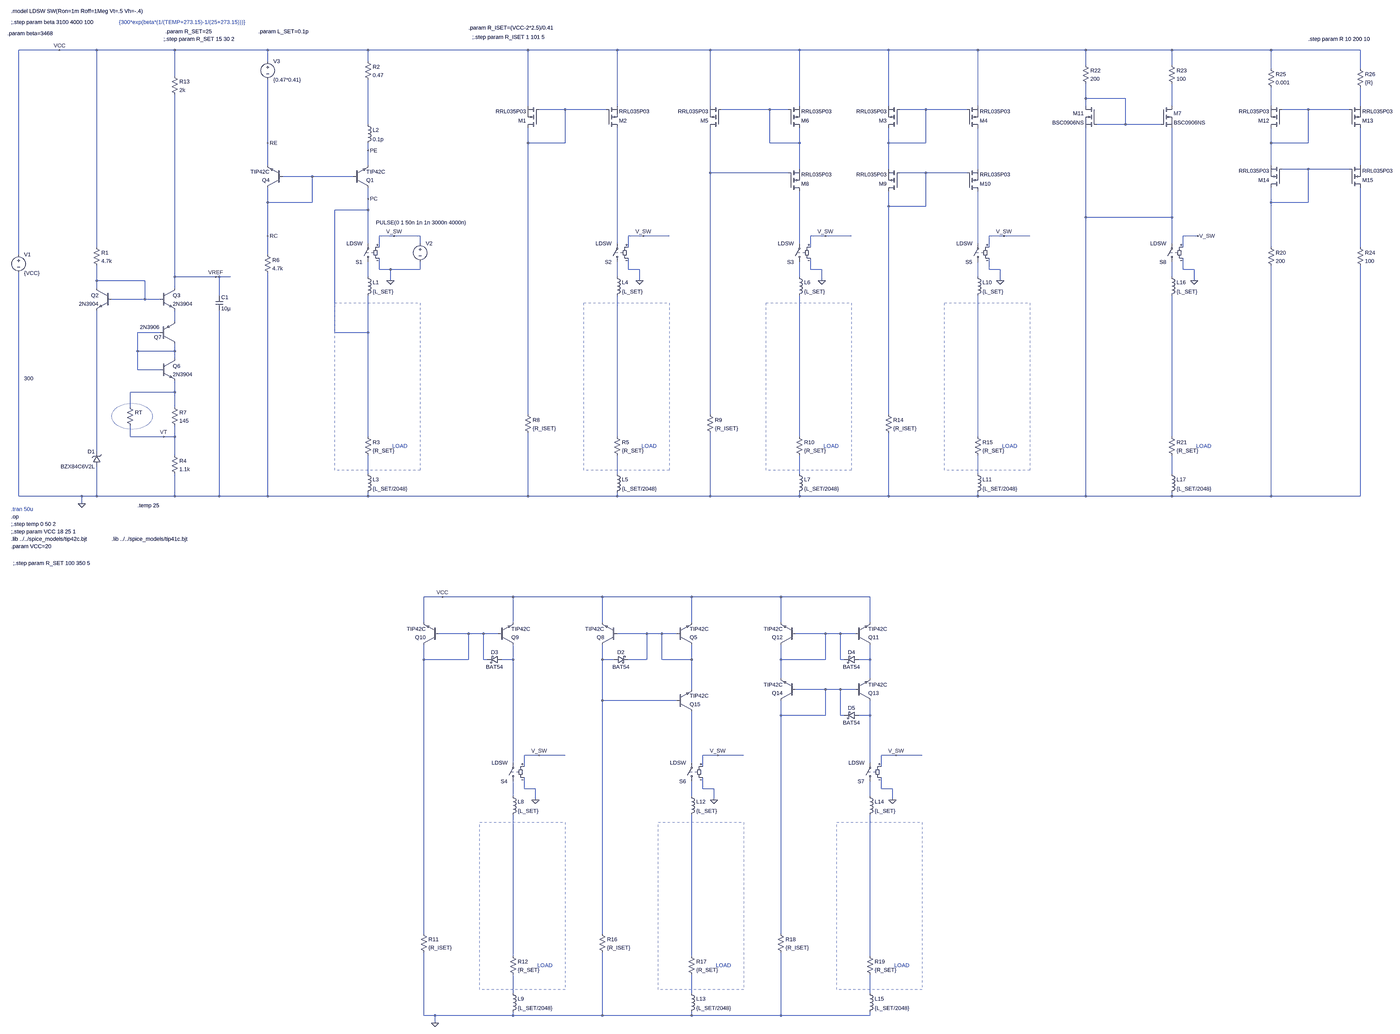
[diagram p0: schematic current_source_back_to_basics.asc, whole sheet]
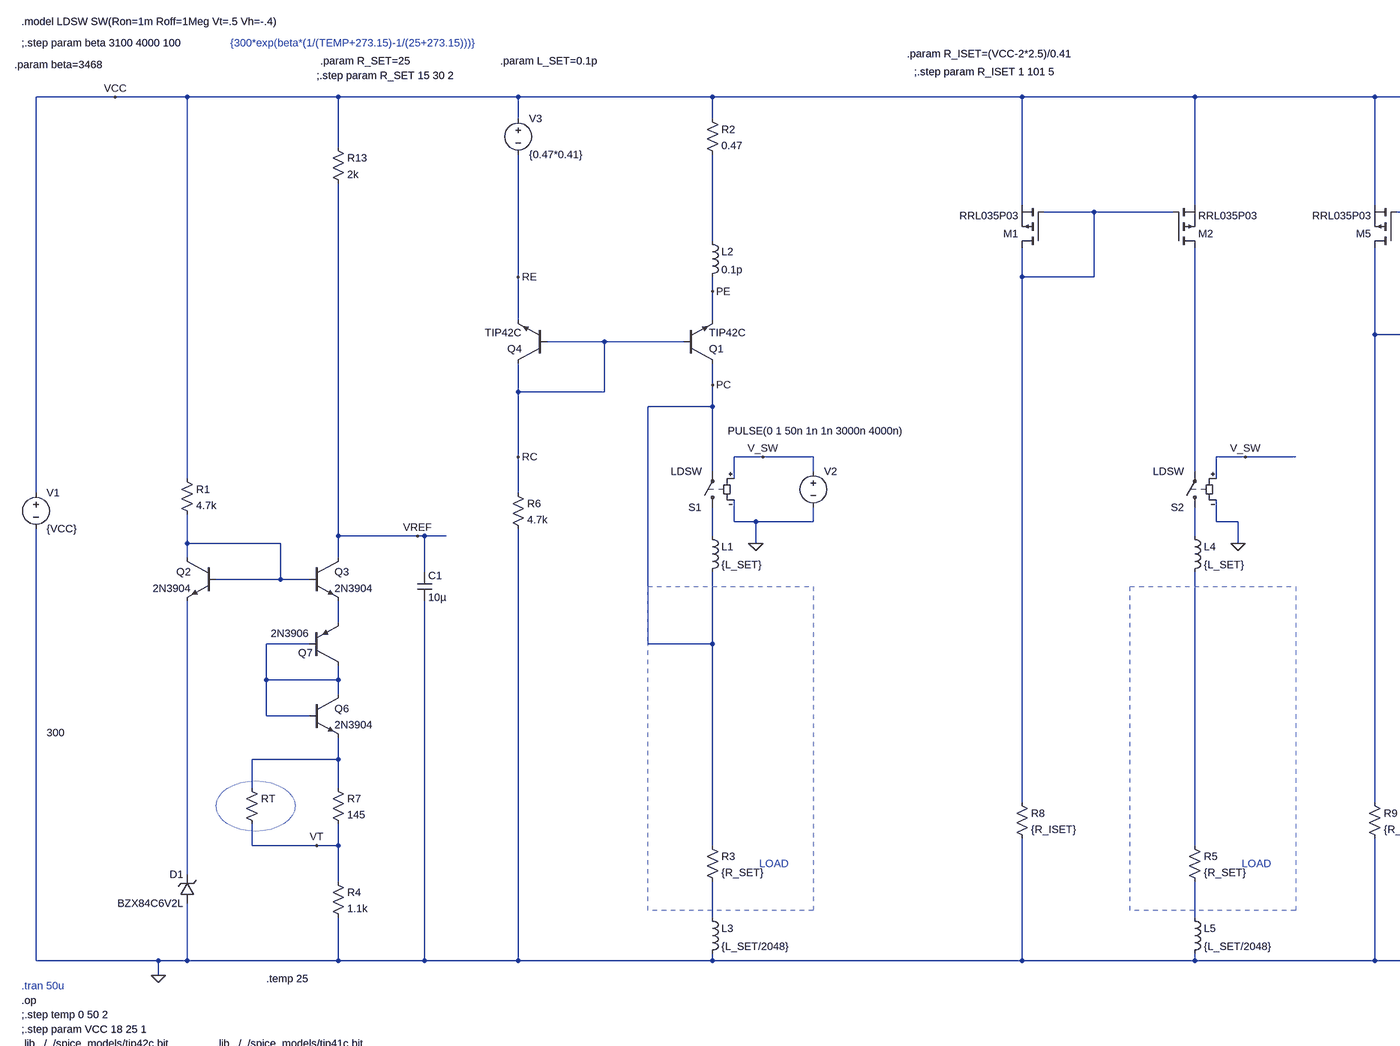
[diagram p1: schematic current_source_back_to_basics.asc, part, row 1 of 2, column 1 of 2]
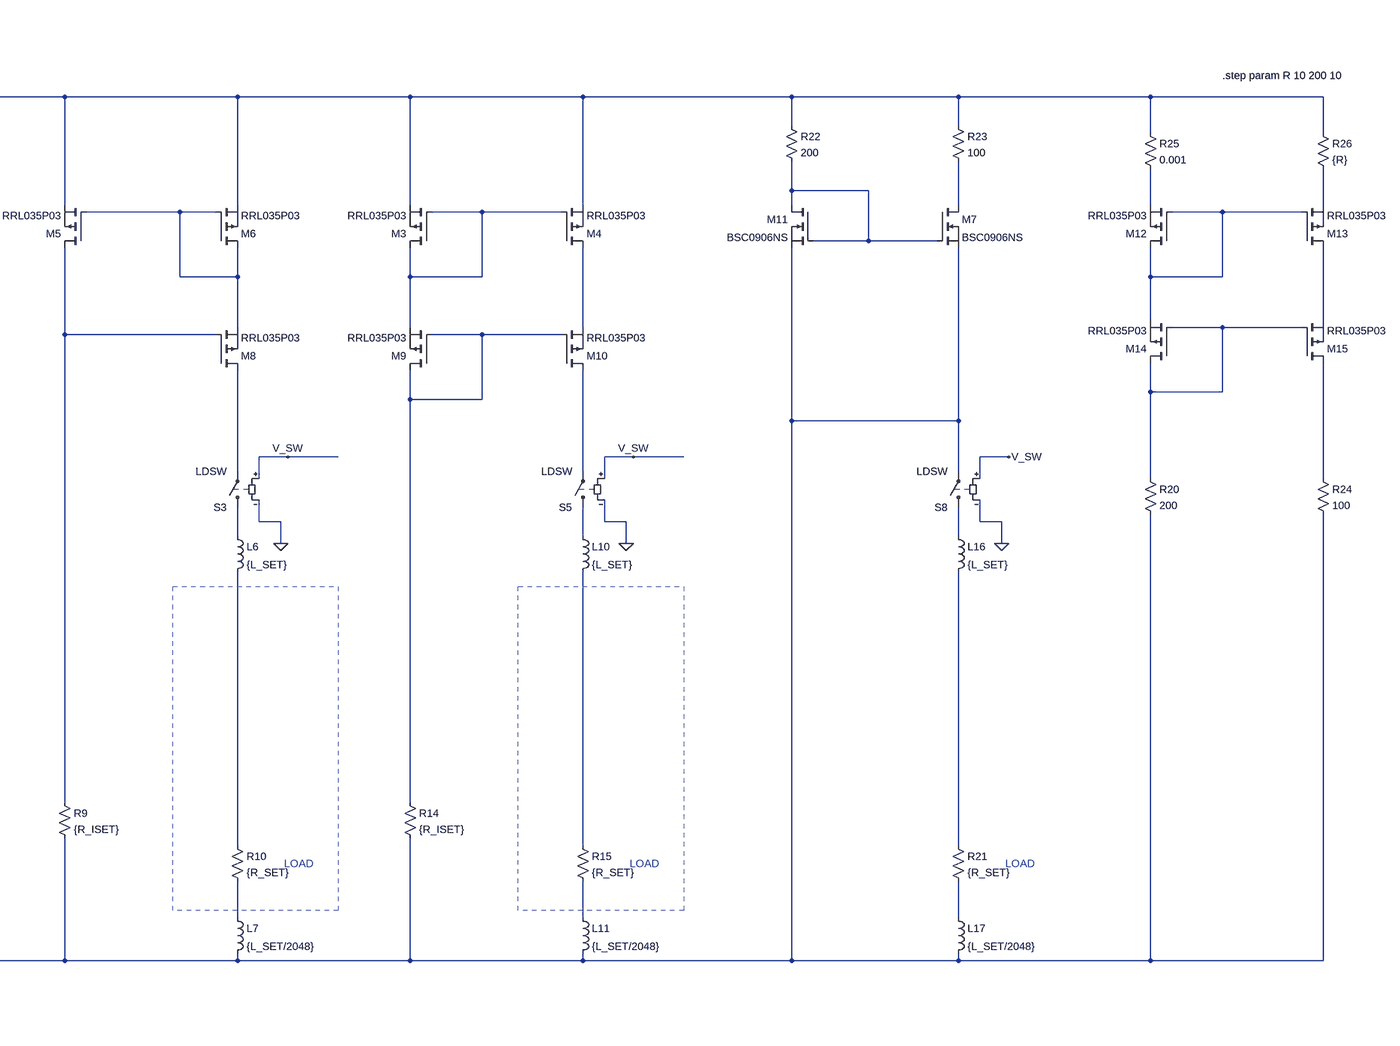
[diagram p2: schematic current_source_back_to_basics.asc, part, row 1 of 2, column 2 of 2]
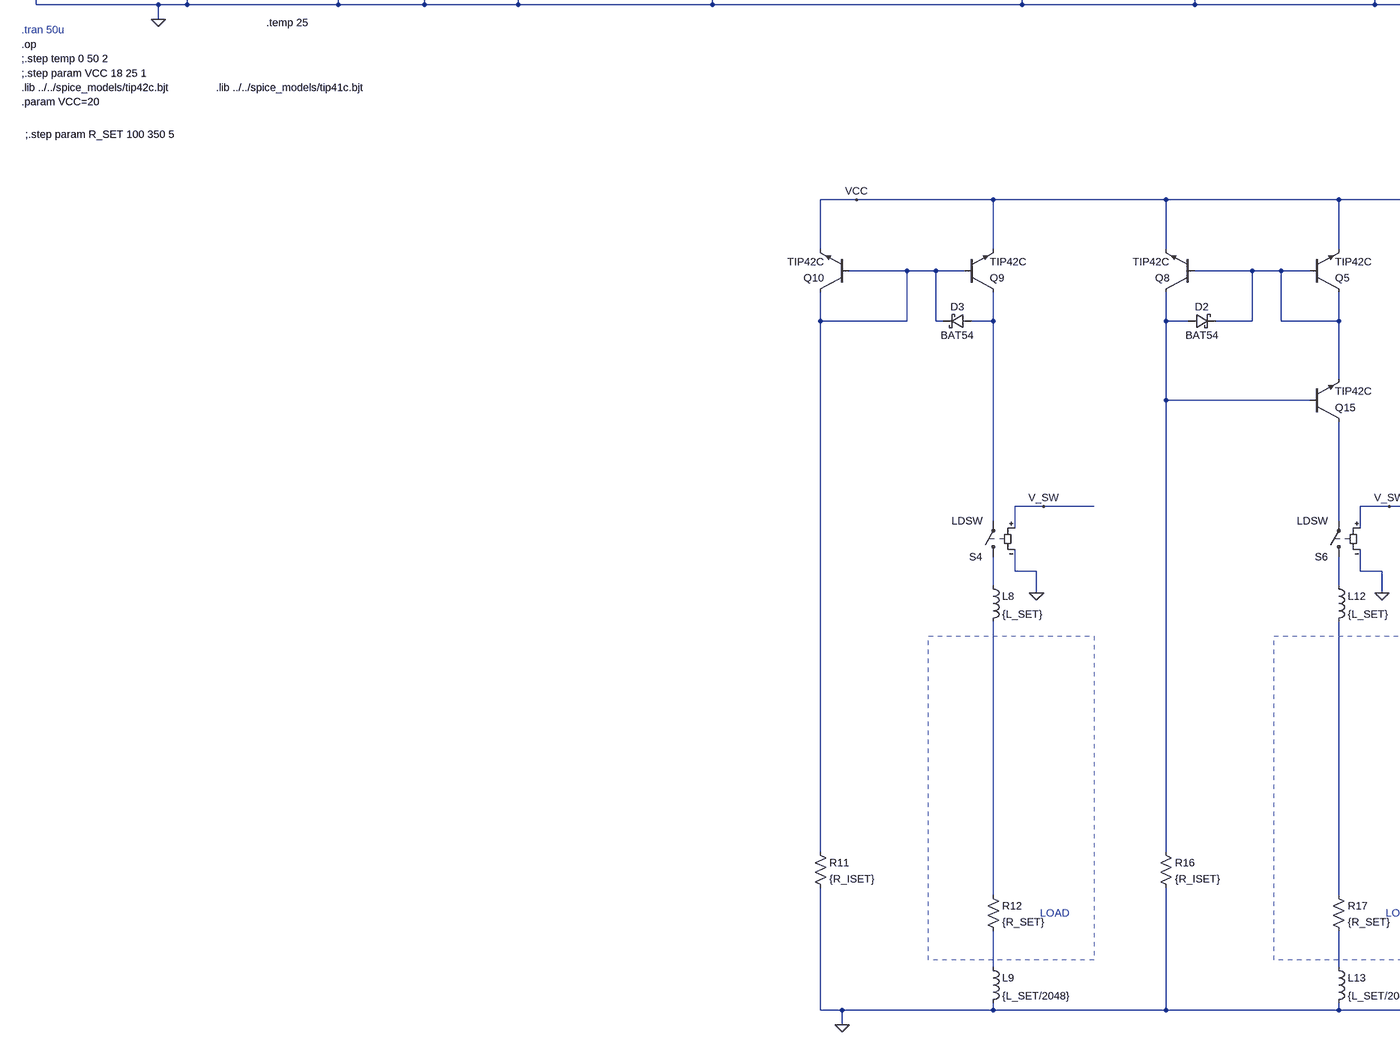
[diagram p3: schematic current_source_back_to_basics.asc, part, row 2 of 2, column 1 of 2]
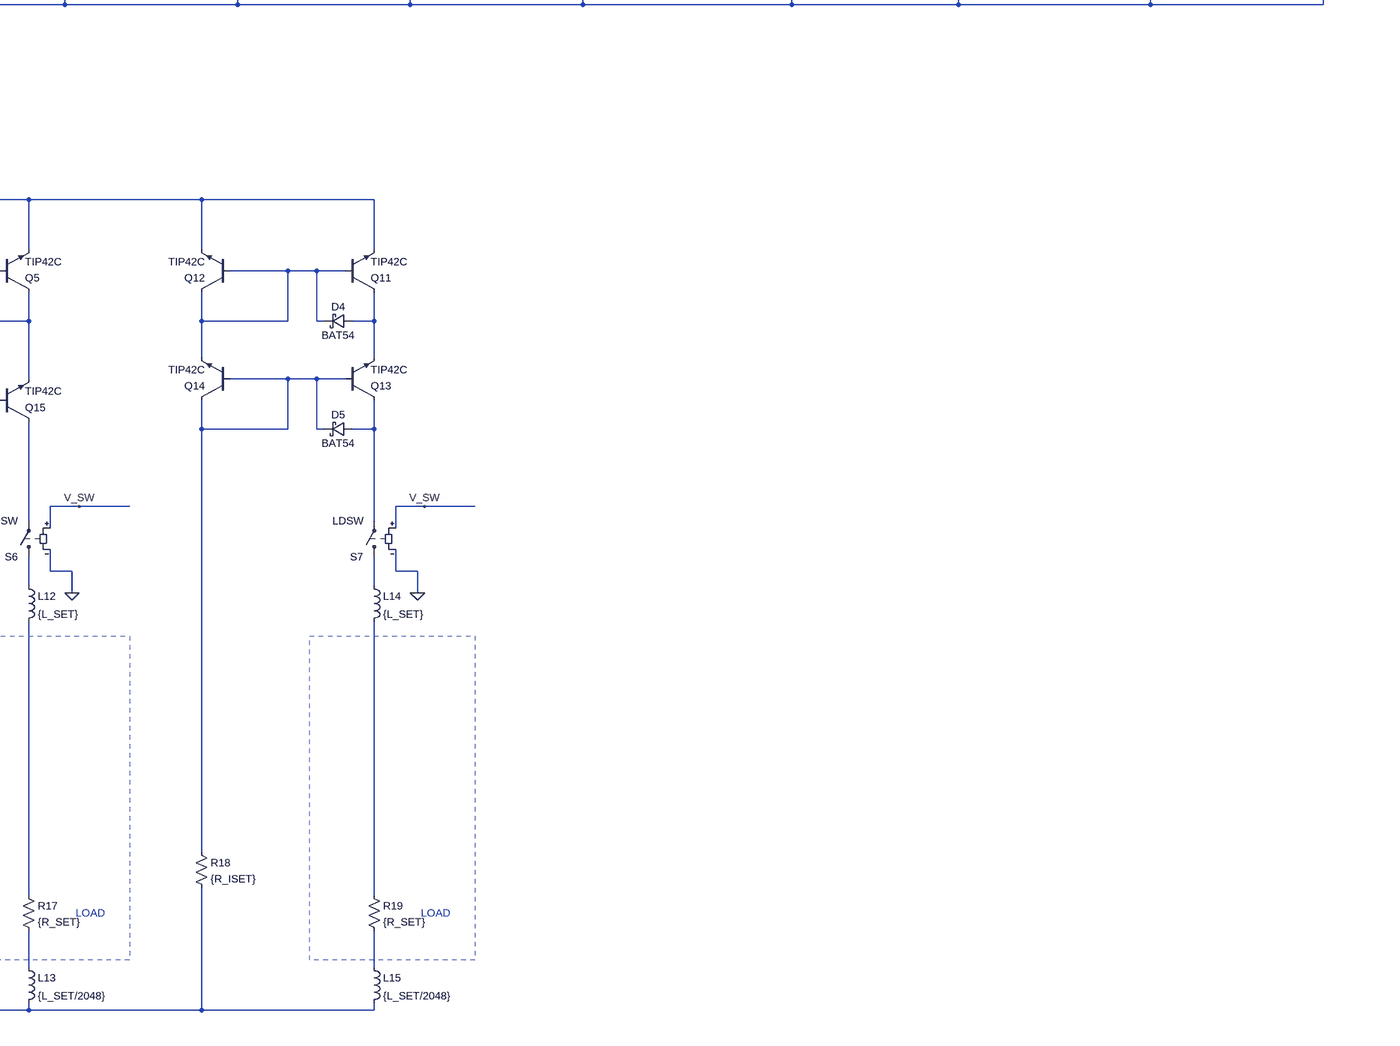
[diagram p4: schematic current_source_back_to_basics.asc, part, row 2 of 2, column 2 of 2]
current_source_back_to_basics.asc, the LTspice schematic file:
Version 4
SHEET 1 5236 3044
WIRE -528 -1328 -704 -1328
WIRE -368 -1328 -528 -1328
WIRE -32 -1328 -368 -1328
WIRE 368 -1328 -32 -1328
WIRE 800 -1328 368 -1328
WIRE 1488 -1328 800 -1328
WIRE 1872 -1328 1488 -1328
WIRE 2272 -1328 1872 -1328
WIRE 2656 -1328 2272 -1328
WIRE 3040 -1328 2656 -1328
WIRE 3424 -1328 3040 -1328
WIRE 3888 -1328 3424 -1328
WIRE 4272 -1328 3888 -1328
WIRE 4704 -1328 4272 -1328
WIRE 5088 -1328 4704 -1328
WIRE 368 -1280 368 -1328
WIRE 800 -1280 800 -1328
WIRE 3888 -1264 3888 -1328
WIRE 4272 -1264 4272 -1328
WIRE 4704 -1248 4704 -1328
WIRE 5088 -1248 5088 -1328
WIRE -32 -1216 -32 -1328
WIRE 3888 -1120 3888 -1184
WIRE 4064 -1120 3888 -1120
WIRE 1488 -1088 1488 -1328
WIRE 1872 -1088 1872 -1328
WIRE 2272 -1088 2272 -1328
WIRE 2656 -1088 2656 -1328
WIRE 3040 -1088 3040 -1328
WIRE 3424 -1088 3424 -1328
WIRE 3888 -1088 3888 -1120
WIRE 4272 -1088 4272 -1184
WIRE 4704 -1088 4704 -1168
WIRE 5088 -1088 5088 -1168
WIRE 1648 -1072 1536 -1072
WIRE 1824 -1072 1648 -1072
WIRE 2528 -1072 2320 -1072
WIRE 2608 -1072 2528 -1072
WIRE 3200 -1072 3088 -1072
WIRE 3376 -1072 3200 -1072
WIRE 4864 -1072 4752 -1072
WIRE 5040 -1072 4864 -1072
WIRE 800 -1008 800 -1200
WIRE 4064 -1008 4064 -1120
WIRE 4064 -1008 3936 -1008
WIRE 4224 -1008 4064 -1008
WIRE 368 -928 368 -1200
WIRE 1488 -928 1488 -992
WIRE 1648 -928 1648 -1072
WIRE 1648 -928 1488 -928
WIRE 2528 -928 2528 -1072
WIRE 2656 -928 2656 -992
WIRE 2656 -928 2528 -928
WIRE 3040 -928 3040 -992
WIRE 3200 -928 3200 -1072
WIRE 3200 -928 3040 -928
WIRE 4704 -928 4704 -992
WIRE 4864 -928 4864 -1072
WIRE 4864 -928 4704 -928
WIRE 800 -896 800 -928
WIRE 368 -832 368 -928
WIRE 800 -832 800 -896
WIRE 4704 -832 4704 -928
WIRE 5088 -832 5088 -992
WIRE 2656 -816 2656 -928
WIRE 3040 -816 3040 -928
WIRE 3424 -816 3424 -992
WIRE 4864 -816 4752 -816
WIRE 5040 -816 4864 -816
WIRE 2272 -800 2272 -992
WIRE 2608 -800 2272 -800
WIRE 3200 -800 3088 -800
WIRE 3376 -800 3200 -800
WIRE 560 -784 432 -784
WIRE 736 -784 560 -784
WIRE 800 -688 800 -736
WIRE 368 -672 368 -736
WIRE 560 -672 560 -784
WIRE 560 -672 368 -672
WIRE 4704 -672 4704 -736
WIRE 4864 -672 4864 -816
WIRE 4864 -672 4704 -672
WIRE 3040 -656 3040 -720
WIRE 3200 -656 3200 -800
WIRE 3200 -656 3040 -656
WIRE 800 -640 800 -688
WIRE 800 -640 656 -640
WIRE 3888 -608 3888 -992
WIRE 4272 -608 4272 -992
WIRE 4272 -608 3888 -608
WIRE 368 -528 368 -672
WIRE 912 -528 848 -528
WIRE 1024 -528 912 -528
WIRE 1984 -528 1920 -528
WIRE 2096 -528 1984 -528
WIRE 2768 -528 2704 -528
WIRE 2880 -528 2768 -528
WIRE 3536 -528 3472 -528
WIRE 3648 -528 3536 -528
WIRE 4384 -528 4320 -528
WIRE 800 -496 800 -640
WIRE 1024 -496 1024 -528
WIRE 1872 -496 1872 -992
WIRE 2656 -496 2656 -720
WIRE 3424 -496 3424 -720
WIRE 4272 -496 4272 -608
WIRE -368 -480 -368 -1328
WIRE 848 -480 848 -528
WIRE 1920 -480 1920 -528
WIRE 2704 -480 2704 -528
WIRE 3472 -480 3472 -528
WIRE 4320 -480 4320 -528
WIRE 4704 -480 4704 -672
WIRE 5088 -480 5088 -736
WIRE -704 -448 -704 -1328
WIRE 368 -448 368 -528
WIRE 848 -384 848 -432
WIRE 896 -384 848 -384
WIRE 1024 -384 1024 -416
WIRE 1024 -384 896 -384
WIRE 1920 -384 1920 -432
WIRE 1968 -384 1920 -384
WIRE 2704 -384 2704 -432
WIRE 2752 -384 2704 -384
WIRE 3472 -384 3472 -432
WIRE 3520 -384 3472 -384
WIRE 4320 -384 4320 -432
WIRE 4368 -384 4320 -384
WIRE -32 -352 -32 -1136
WIRE 144 -352 -32 -352
WIRE 160 -352 144 -352
WIRE 208 -352 160 -352
WIRE 800 -352 800 -416
WIRE 1872 -352 1872 -416
WIRE 2656 -352 2656 -416
WIRE 3424 -352 3424 -416
WIRE 4272 -352 4272 -416
WIRE -368 -336 -368 -400
WIRE -160 -336 -368 -336
WIRE 896 -336 896 -384
WIRE 1968 -336 1968 -384
WIRE 2752 -336 2752 -384
WIRE 3520 -336 3520 -384
WIRE 4368 -336 4368 -384
WIRE -368 -304 -368 -336
WIRE -32 -304 -32 -352
WIRE 160 -272 160 -352
WIRE -160 -256 -160 -336
WIRE -160 -256 -304 -256
WIRE -96 -256 -160 -256
WIRE -32 -160 -32 -208
WIRE -96 -112 -192 -112
WIRE 656 -112 656 -640
WIRE 800 -112 800 -272
WIRE 800 -112 656 -112
WIRE -192 -32 -192 -112
WIRE -32 -32 -32 -64
WIRE -32 -32 -192 -32
WIRE -32 0 -32 -32
WIRE -192 48 -192 -32
WIRE -96 48 -192 48
WIRE -32 144 -32 96
WIRE -32 144 -224 144
WIRE -224 208 -224 144
WIRE -32 208 -32 144
WIRE 1488 240 1488 -928
WIRE 2272 240 2272 -800
WIRE 3040 240 3040 -656
WIRE -224 336 -224 288
WIRE -80 336 -224 336
WIRE -32 336 -32 288
WIRE -32 336 -80 336
WIRE 800 336 800 -112
WIRE 1872 336 1872 -272
WIRE 2656 336 2656 -272
WIRE 3424 336 3424 -272
WIRE 4272 336 4272 -272
WIRE -368 400 -368 -208
WIRE -32 416 -32 336
WIRE 800 496 800 416
WIRE 1872 496 1872 416
WIRE 2656 496 2656 416
WIRE 3424 496 3424 416
WIRE 4272 496 4272 416
WIRE -704 592 -704 -368
WIRE -432 592 -704 592
WIRE -368 592 -368 464
WIRE -368 592 -432 592
WIRE -32 592 -32 496
WIRE -32 592 -368 592
WIRE 160 592 160 -208
WIRE 160 592 -32 592
WIRE 368 592 368 -368
WIRE 368 592 160 592
WIRE 800 592 800 576
WIRE 800 592 368 592
WIRE 1488 592 1488 320
WIRE 1488 592 800 592
WIRE 1872 592 1872 576
WIRE 1872 592 1488 592
WIRE 2272 592 2272 320
WIRE 2272 592 1872 592
WIRE 2656 592 2656 576
WIRE 2656 592 2272 592
WIRE 3040 592 3040 320
WIRE 3040 592 2656 592
WIRE 3424 592 3424 576
WIRE 3424 592 3040 592
WIRE 3888 592 3888 -608
WIRE 3888 592 3424 592
WIRE 4272 592 4272 576
WIRE 4272 592 3888 592
WIRE 4704 592 4704 -400
WIRE 4704 592 4272 592
WIRE 5088 592 5088 -400
WIRE 5088 592 4704 592
WIRE -432 624 -432 592
WIRE 1120 1072 1040 1072
WIRE 1424 1072 1120 1072
WIRE 1808 1072 1424 1072
WIRE 2192 1072 1808 1072
WIRE 2576 1072 2192 1072
WIRE 2960 1072 2576 1072
WIRE 1040 1232 1040 1072
WIRE 1424 1232 1424 1072
WIRE 1808 1232 1808 1072
WIRE 2192 1232 2192 1072
WIRE 2576 1232 2576 1072
WIRE 2960 1232 2960 1072
WIRE 1232 1280 1104 1280
WIRE 1296 1280 1232 1280
WIRE 1360 1280 1296 1280
WIRE 2000 1280 1872 1280
WIRE 2064 1280 2000 1280
WIRE 2128 1280 2064 1280
WIRE 2768 1280 2640 1280
WIRE 2832 1280 2768 1280
WIRE 2896 1280 2832 1280
WIRE 1040 1392 1040 1328
WIRE 1232 1392 1232 1280
WIRE 1232 1392 1040 1392
WIRE 1296 1392 1296 1280
WIRE 1312 1392 1296 1392
WIRE 1424 1392 1424 1328
WIRE 1424 1392 1376 1392
WIRE 1808 1392 1808 1328
WIRE 1856 1392 1808 1392
WIRE 2000 1392 2000 1280
WIRE 2000 1392 1920 1392
WIRE 2064 1392 2064 1280
WIRE 2192 1392 2192 1328
WIRE 2192 1392 2064 1392
WIRE 2576 1392 2576 1328
WIRE 2768 1392 2768 1280
WIRE 2768 1392 2576 1392
WIRE 2832 1392 2832 1280
WIRE 2848 1392 2832 1392
WIRE 2960 1392 2960 1328
WIRE 2960 1392 2912 1392
WIRE 2576 1472 2576 1392
WIRE 2960 1472 2960 1392
WIRE 2192 1520 2192 1392
WIRE 2768 1520 2640 1520
WIRE 2832 1520 2768 1520
WIRE 2896 1520 2832 1520
WIRE 1808 1568 1808 1392
WIRE 2128 1568 1808 1568
WIRE 2576 1632 2576 1568
WIRE 2768 1632 2768 1520
WIRE 2768 1632 2576 1632
WIRE 2832 1632 2832 1520
WIRE 2848 1632 2832 1632
WIRE 2960 1632 2960 1568
WIRE 2960 1632 2912 1632
WIRE 1536 1872 1472 1872
WIRE 1648 1872 1536 1872
WIRE 2304 1872 2240 1872
WIRE 2416 1872 2304 1872
WIRE 3072 1872 3008 1872
WIRE 3184 1872 3072 1872
WIRE 1424 1904 1424 1392
WIRE 2192 1904 2192 1616
WIRE 2960 1904 2960 1632
WIRE 1472 1920 1472 1872
WIRE 2240 1920 2240 1872
WIRE 3008 1920 3008 1872
WIRE 1472 2016 1472 1968
WIRE 1520 2016 1472 2016
WIRE 2240 2016 2240 1968
WIRE 2288 2016 2240 2016
WIRE 3008 2016 3008 1968
WIRE 3056 2016 3008 2016
WIRE 1424 2048 1424 1984
WIRE 2192 2048 2192 1984
WIRE 2960 2048 2960 1984
WIRE 1520 2064 1520 2016
WIRE 2288 2064 2288 2016
WIRE 3056 2064 3056 2016
WIRE 1040 2640 1040 1392
WIRE 1808 2640 1808 1568
WIRE 2576 2640 2576 1632
WIRE 1424 2736 1424 2128
WIRE 2192 2736 2192 2128
WIRE 2960 2736 2960 2128
WIRE 1424 2896 1424 2816
WIRE 2192 2896 2192 2816
WIRE 2960 2896 2960 2816
WIRE 1040 2992 1040 2720
WIRE 1088 2992 1040 2992
WIRE 1424 2992 1424 2976
WIRE 1424 2992 1088 2992
WIRE 1808 2992 1808 2720
WIRE 1808 2992 1424 2992
WIRE 2192 2992 2192 2976
WIRE 2192 2992 1808 2992
WIRE 2576 2992 2576 2720
WIRE 2576 2992 2192 2992
WIRE 2960 2992 2960 2976
WIRE 2960 2992 2576 2992
WIRE 1088 3024 1088 2992
FLAG -432 624 0
FLAG 800 -896 PE
FLAG 800 -688 PC
FLAG -80 336 VT
FLAG -528 -1328 VCC
FLAG 896 -336 0
FLAG 912 -528 V_SW
FLAG 144 -352 VREF
FLAG 368 -528 RC
FLAG 368 -928 RE
FLAG 1968 -336 0
FLAG 1984 -528 V_SW
FLAG 2752 -336 0
FLAG 2768 -528 V_SW
FLAG 1520 2064 0
FLAG 1536 1872 V_SW
FLAG 1088 3024 0
FLAG 1120 1072 VCC
FLAG 3520 -336 0
FLAG 3536 -528 V_SW
FLAG 2288 2064 0
FLAG 2304 1872 V_SW
FLAG 3056 2064 0
FLAG 3072 1872 V_SW
FLAG 4368 -336 0
FLAG 4384 -528 V_SW
SYMBOL npn -304 -304 M0
SYMATTR InstName Q2
SYMATTR Value 2N3904
SYMBOL zener -352 464 R180
WINDOW 0 24 64 Left 2
WINDOW 3 24 0 Left 2
SYMATTR InstName D1
SYMATTR Value BZX84C6V2L
SYMBOL res -384 -496 R0
SYMATTR InstName R1
SYMATTR Value 4.7k
SYMBOL res 784 -1296 R0
SYMATTR InstName R2
SYMATTR Value 0.47
SYMBOL res 784 320 R0
SYMATTR InstName R3
SYMATTR Value {R_SET}
SYMBOL voltage -704 -464 R0
SYMATTR InstName V1
SYMATTR Value {VCC}
SYMBOL npn -96 -304 R0
SYMATTR InstName Q3
SYMATTR Value 2N3904
SYMBOL res -48 400 R0
SYMATTR InstName R4
SYMATTR Value 1.1k
SYMBOL pnp -96 -64 M180
WINDOW 0 -25 28 Left 2
WINDOW 3 -86 72 Left 2
SYMATTR InstName Q7
SYMATTR Value 2N3906
SYMBOL npn -96 0 R0
SYMATTR InstName Q6
SYMATTR Value 2N3904
SYMBOL res -48 192 R0
SYMATTR InstName R7
SYMATTR Value 145
SYMBOL res -48 -1232 R0
SYMATTR InstName R13
SYMATTR Value 2k
SYMBOL res -240 192 R0
WINDOW 3 -440 -107 Left 2
SYMATTR Value 300
SYMATTR InstName RT
SYMBOL sw 800 -400 R180
SYMATTR InstName S1
SYMATTR Value LDSW
SYMBOL voltage 1024 -512 R0
WINDOW 123 0 0 Left 0
WINDOW 39 0 0 Left 0
WINDOW 3 -190 -74 Left 2
SYMATTR Value PULSE(0 1 50n 1n 1n 3000n 4000n)
SYMATTR InstName V2
SYMBOL ind 784 -368 R0
SYMATTR InstName L1
SYMATTR Value {L_SET}
SYMBOL ind 784 -1024 R0
SYMATTR InstName L2
SYMATTR Value 0.1p
SYMBOL ind 784 480 R0
SYMATTR InstName L3
SYMATTR Value {L_SET/2048}
SYMBOL npn 736 -736 M180
SYMATTR InstName Q1
SYMATTR Value TIP42C
SYMBOL npn 432 -736 R180
SYMATTR InstName Q4
SYMATTR Value TIP42C
SYMBOL cap 144 -272 R0
SYMATTR InstName C1
SYMATTR Value 10µ
SYMBOL res 352 -464 R0
SYMATTR InstName R6
SYMATTR Value 4.7k
SYMBOL voltage 368 -1296 R0
SYMATTR InstName V3
SYMATTR Value {0.47*0.41}
SYMBOL pmos 1536 -992 R180
SYMATTR InstName M1
SYMATTR Value RRL035P03
SYMBOL pmos 1824 -992 M180
SYMATTR InstName M2
SYMATTR Value RRL035P03
SYMBOL res 1472 224 R0
SYMATTR InstName R8
SYMATTR Value {R_ISET}
SYMBOL res 1856 320 R0
SYMATTR InstName R5
SYMATTR Value {R_SET}
SYMBOL sw 1872 -400 R180
SYMATTR InstName S2
SYMATTR Value LDSW
SYMBOL ind 1856 -368 R0
SYMATTR InstName L4
SYMATTR Value {L_SET}
SYMBOL ind 1856 480 R0
SYMATTR InstName L5
SYMATTR Value {L_SET/2048}
SYMBOL res 2256 224 R0
SYMATTR InstName R9
SYMATTR Value {R_ISET}
SYMBOL res 2640 320 R0
SYMATTR InstName R10
SYMATTR Value {R_SET}
SYMBOL sw 2656 -400 R180
SYMATTR InstName S3
SYMATTR Value LDSW
SYMBOL ind 2640 -368 R0
SYMATTR InstName L6
SYMATTR Value {L_SET}
SYMBOL ind 2640 480 R0
SYMATTR InstName L7
SYMATTR Value {L_SET/2048}
SYMBOL res 1024 2624 R0
SYMATTR InstName R11
SYMATTR Value {R_ISET}
SYMBOL res 1408 2720 R0
SYMATTR InstName R12
SYMATTR Value {R_SET}
SYMBOL sw 1424 2000 R180
SYMATTR InstName S4
SYMATTR Value LDSW
SYMBOL ind 1408 2032 R0
SYMATTR InstName L8
SYMATTR Value {L_SET}
SYMBOL ind 1408 2880 R0
SYMATTR InstName L9
SYMATTR Value {L_SET/2048}
SYMBOL npn 1360 1328 M180
SYMATTR InstName Q9
SYMATTR Value TIP42C
SYMBOL npn 1104 1328 R180
SYMATTR InstName Q10
SYMATTR Value TIP42C
SYMBOL schottky 1376 1376 R90
WINDOW 0 0 32 VBottom 2
WINDOW 3 32 32 VTop 2
SYMATTR InstName D3
SYMATTR Value BAT54
SYMATTR Description Diode
SYMATTR Type diode
SYMBOL pmos 2320 -992 R180
SYMATTR InstName M5
SYMATTR Value RRL035P03
SYMBOL pmos 2608 -992 M180
SYMATTR InstName M6
SYMATTR Value RRL035P03
SYMBOL pmos 2608 -720 M180
SYMATTR InstName M8
SYMATTR Value RRL035P03
SYMBOL res 3024 224 R0
SYMATTR InstName R14
SYMATTR Value {R_ISET}
SYMBOL res 3408 320 R0
SYMATTR InstName R15
SYMATTR Value {R_SET}
SYMBOL sw 3424 -400 R180
SYMATTR InstName S5
SYMATTR Value LDSW
SYMBOL ind 3408 -368 R0
SYMATTR InstName L10
SYMATTR Value {L_SET}
SYMBOL ind 3408 480 R0
SYMATTR InstName L11
SYMATTR Value {L_SET/2048}
SYMBOL pmos 3088 -992 R180
SYMATTR InstName M3
SYMATTR Value RRL035P03
SYMBOL pmos 3376 -992 M180
SYMATTR InstName M4
SYMATTR Value RRL035P03
SYMBOL pmos 3088 -720 R180
SYMATTR InstName M9
SYMATTR Value RRL035P03
SYMBOL pmos 3376 -720 M180
SYMATTR InstName M10
SYMATTR Value RRL035P03
SYMBOL res 1792 2624 R0
SYMATTR InstName R16
SYMATTR Value {R_ISET}
SYMBOL res 2176 2720 R0
SYMATTR InstName R17
SYMATTR Value {R_SET}
SYMBOL sw 2192 2000 R180
SYMATTR InstName S6
SYMATTR Value LDSW
SYMBOL ind 2176 2032 R0
SYMATTR InstName L12
SYMATTR Value {L_SET}
SYMBOL ind 2176 2880 R0
SYMATTR InstName L13
SYMATTR Value {L_SET/2048}
SYMBOL npn 2128 1328 M180
SYMATTR InstName Q5
SYMATTR Value TIP42C
SYMBOL npn 1872 1328 R180
SYMATTR InstName Q8
SYMATTR Value TIP42C
SYMBOL schottky 1856 1408 R270
WINDOW 0 32 32 VTop 2
WINDOW 3 0 32 VBottom 2
SYMATTR InstName D2
SYMATTR Value BAT54
SYMATTR Description Diode
SYMATTR Type diode
SYMBOL res 2560 2624 R0
SYMATTR InstName R18
SYMATTR Value {R_ISET}
SYMBOL res 2944 2720 R0
SYMATTR InstName R19
SYMATTR Value {R_SET}
SYMBOL sw 2960 2000 R180
SYMATTR InstName S7
SYMATTR Value LDSW
SYMBOL ind 2944 2032 R0
SYMATTR InstName L14
SYMATTR Value {L_SET}
SYMBOL ind 2944 2880 R0
SYMATTR InstName L15
SYMATTR Value {L_SET/2048}
SYMBOL npn 2896 1328 M180
SYMATTR InstName Q11
SYMATTR Value TIP42C
SYMBOL npn 2640 1328 R180
SYMATTR InstName Q12
SYMATTR Value TIP42C
SYMBOL schottky 2912 1376 R90
WINDOW 0 0 32 VBottom 2
WINDOW 3 32 32 VTop 2
SYMATTR InstName D4
SYMATTR Value BAT54
SYMATTR Description Diode
SYMATTR Type diode
SYMBOL npn 2896 1568 M180
SYMATTR InstName Q13
SYMATTR Value TIP42C
SYMBOL npn 2640 1568 R180
SYMATTR InstName Q14
SYMATTR Value TIP42C
SYMBOL schottky 2912 1616 R90
WINDOW 0 0 32 VBottom 2
WINDOW 3 32 32 VTop 2
SYMATTR InstName D5
SYMATTR Value BAT54
SYMATTR Description Diode
SYMATTR Type diode
SYMBOL npn 2128 1616 M180
SYMATTR InstName Q15
SYMATTR Value TIP42C
SYMBOL res 4256 320 R0
SYMATTR InstName R21
SYMATTR Value {R_SET}
SYMBOL sw 4272 -400 R180
SYMATTR InstName S8
SYMATTR Value LDSW
SYMBOL ind 4256 -368 R0
SYMATTR InstName L16
SYMATTR Value {L_SET}
SYMBOL ind 4256 480 R0
SYMATTR InstName L17
SYMATTR Value {L_SET/2048}
SYMBOL nmos 4224 -1088 R0
SYMATTR InstName M7
SYMATTR Value BSC0906NS
SYMBOL nmos 3936 -1088 M0
SYMATTR InstName M11
SYMATTR Value BSC0906NS
SYMBOL res 3872 -1280 R0
SYMATTR InstName R22
SYMATTR Value 200
SYMBOL res 4256 -1280 R0
SYMATTR InstName R23
SYMATTR Value 100
SYMBOL pmos 4752 -992 R180
SYMATTR InstName M12
SYMATTR Value RRL035P03
SYMBOL pmos 5040 -992 M180
SYMATTR InstName M13
SYMATTR Value RRL035P03
SYMBOL res 4688 -496 R0
SYMATTR InstName R20
SYMATTR Value 200
SYMBOL res 5072 -496 R0
SYMATTR InstName R24
SYMATTR Value 100
SYMBOL pmos 4752 -736 R180
SYMATTR InstName M14
SYMATTR Value RRL035P03
SYMBOL pmos 5040 -736 M180
SYMATTR InstName M15
SYMATTR Value RRL035P03
SYMBOL res 4688 -1264 R0
SYMATTR InstName R25
SYMATTR Value 0.001
SYMBOL res 5072 -1264 R0
SYMATTR InstName R26
SYMATTR Value {R}
TEXT -736 648 Left 2 ;.tran 50u
TEXT -736 712 Left 2 !;.step temp 0 50 2
TEXT 904 376 Left 2 ;LOAD
TEXT -736 680 Left 2 !.op
TEXT -72 -1408 Left 2 !.param R_SET=25
TEXT -736 744 Left 2 !;.step param VCC 18 25 1
TEXT -736 776 Left 2 !.lib ../../spice_models/tip42c.bjt
TEXT -736 808 Left 2 !.param VCC=20
TEXT -728 880 Left 2 !;.step param R_SET 100 350 5
TEXT -752 -1400 Left 2 !.param beta=3468
TEXT -736 -1448 Left 2 !;.step param beta 3100 4000 100
TEXT -272 -1448 Left 2 ;{300*exp(beta*(1/(TEMP+273.15)-1/(25+273.15)))}
TEXT -80 -1376 Left 2 !;.step param R_SET 15 30 2
TEXT -736 -1496 Left 2 !.model LDSW SW(Ron=1m Roff=1Meg Vt=.5 Vh=-.4)
TEXT -192 632 Left 2 !.temp 25
TEXT -304 776 Left 2 !.lib ../../spice_models/tip41c.bjt
TEXT 1248 -1384 Left 2 !;.step param R_ISET 1 101 5
TEXT 1976 376 Left 2 ;LOAD
TEXT 1232 -1424 Left 2 !.param R_ISET=(VCC-2*2.5)/0.41
TEXT 2760 376 Left 2 ;LOAD
TEXT 1528 2776 Left 2 ;LOAD
TEXT 3528 376 Left 2 ;LOAD
TEXT 328 -1408 Left 2 !.param L_SET=0.1p
TEXT 2296 2776 Left 2 ;LOAD
TEXT 3064 2776 Left 2 ;LOAD
TEXT 4376 376 Left 2 ;LOAD
TEXT 4864 -1376 Left 2 !.step param R 10 200 10
RECTANGLE Normal 1024 480 656 -240 2
RECTANGLE Normal 2096 480 1728 -240 2
RECTANGLE Normal 2880 480 2512 -240 2
RECTANGLE Normal 1648 2880 1280 2160 2
RECTANGLE Normal 3648 480 3280 -240 2
RECTANGLE Normal 2416 2880 2048 2160 2
RECTANGLE Normal 3184 2880 2816 2160 2
CIRCLE Normal -128 304 -304 192 2

The netlist it stands for:
* current_source_back_to_basics.asc
Q2 N024 N024 N032 0 2N3904
D1 0 N032 BZX84C6V2L
R1 VCC N024 4.7k
R2 VCC N009 0.47
R3 PC N033 {R_SET}
V1 VCC 0 {VCC}
Q3 VREF N024 N025 0 2N3904
R4 VT 0 1.1k
Q7 N026 N026 N025 0 2N3906
Q6 N026 N026 N027 0 2N3904
R7 N027 VT 145
R13 VCC VREF 2k
RT N027 VT 300
S1 N019 PC V_SW 0 LDSW
V2 V_SW 0 PULSE(0 1 50n 1n 1n 3000n 4000n)
L1 N019 PC {L_SET}
L2 N009 PE 0.1p
L3 N033 0 {L_SET/2048}
Q1 PC RC PE 0 TIP42C
Q4 RC RC RE 0 TIP42C
C1 VREF 0 10µ
R6 RC 0 4.7k
V3 VCC RE {0.47*0.41}
M1 N005 N005 VCC VCC RRL035P03
M2 N015 N005 VCC VCC RRL035P03
R8 N005 0 {R_ISET}
R5 N028 N034 {R_SET}
S2 N020 N015 V_SW 0 LDSW
L4 N020 N028 {L_SET}
L5 N034 0 {L_SET/2048}
R9 N013 0 {R_ISET}
R10 N029 N035 {R_SET}
S3 N021 N016 V_SW 0 LDSW
L6 N021 N029 {L_SET}
L7 N035 0 {L_SET/2048}
R11 N038 0 {R_ISET}
R12 N050 N053 {R_SET}
S4 N047 N041 V_SW 0 LDSW
L8 N047 N050 {L_SET}
L9 N053 0 {L_SET/2048}
Q9 N041 N038 VCC 0 TIP42C
Q10 N038 N038 VCC 0 TIP42C
D3 N041 N038 BAT54
M5 N013 N006 VCC VCC RRL035P03
M6 N006 N006 VCC VCC RRL035P03
M8 N016 N013 N006 N006 RRL035P03
R14 N014 0 {R_ISET}
R15 N030 N036 {R_SET}
S5 N022 N017 V_SW 0 LDSW
L10 N022 N030 {L_SET}
L11 N036 0 {L_SET/2048}
M3 N007 N007 VCC VCC RRL035P03
M4 N011 N007 VCC VCC RRL035P03
M9 N014 N014 N007 N007 RRL035P03
M10 N017 N014 N011 N011 RRL035P03
R16 N042 0 {R_ISET}
R17 N051 N054 {R_SET}
S6 N048 N046 V_SW 0 LDSW
L12 N048 N051 {L_SET}
L13 N054 0 {L_SET/2048}
Q5 N039 N039 VCC 0 TIP42C
Q8 N042 N039 VCC 0 TIP42C
D2 N042 N039 BAT54
R18 N044 0 {R_ISET}
R19 N052 N055 {R_SET}
S7 N049 N045 V_SW 0 LDSW
L14 N049 N052 {L_SET}
L15 N055 0 {L_SET/2048}
Q11 N043 N040 VCC 0 TIP42C
Q12 N040 N040 VCC 0 TIP42C
D4 N043 N040 BAT54
Q13 N045 N044 N043 0 TIP42C
Q14 N044 N044 N040 0 TIP42C
D5 N045 N044 BAT54
Q15 N046 N042 N039 0 TIP42C
R21 N031 N037 {R_SET}
S8 N023 0 V_SW 0 LDSW
L16 N023 N031 {L_SET}
L17 N037 0 {L_SET/2048}
M7 N002 N001 0 0 BSC0906NS
M11 N001 N001 0 0 BSC0906NS
R22 VCC N001 200
R23 VCC N002 100
M12 N008 N008 N003 N003 RRL035P03
M13 N010 N008 N004 N004 RRL035P03
R20 N012 0 200
R24 N018 0 100
M14 N012 N012 N008 N008 RRL035P03
M15 N018 N012 N010 N010 RRL035P03
R25 VCC N003 0.001
R26 VCC N004 {R}
.model D D
.lib standard.dio
.model NPN NPN
.model PNP PNP
.lib standard.bjt
.model NMOS NMOS
.model PMOS PMOS
.lib standard.mos
* .tran 50u
;.step temp 0 50 2
* LOAD
.op
.param R_SET=25
;.step param VCC 18 25 1
.lib ../../spice_models/tip42c.bjt
.param VCC=20
;.step param R_SET 100 350 5
.param beta=3468
;.step param beta 3100 4000 100
* {300*exp(beta*(1/(TEMP+273.15)-1/(25+273.15)))}
;.step param R_SET 15 30 2
.model LDSW SW(Ron=1m Roff=1Meg Vt=.5 Vh=-.4)
.temp 25
.lib ../../spice_models/tip41c.bjt
;.step param R_ISET 1 101 5
* LOAD
.param R_ISET=(VCC-2*2.5)/0.41
* LOAD
* LOAD
* LOAD
.param L_SET=0.1p
* LOAD
* LOAD
* LOAD
.step param R 10 200 10
.backanno
.end